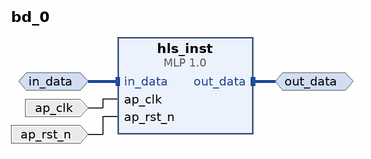
[diagram p0: block diagram of the top level]
# Vivado block design bd_0, xczu3eg-sbva484-2-i, Vivado 2022.1
create_bd_design bd_0

create_bd_intf_port -mode Slave -vlnv xilinx.com:interface:axis_rtl:1.0 in_data
set_property -dict [list \
  CONFIG.FREQ_HZ 100000000.0 \
  CONFIG.HAS_TKEEP 1 \
  CONFIG.HAS_TLAST 1 \
  CONFIG.HAS_TREADY 1 \
  CONFIG.HAS_TSTRB 1 \
  CONFIG.LAYERED_METADATA undef \
  CONFIG.TDATA_NUM_BYTES 4 \
  CONFIG.TDEST_WIDTH 6 \
  CONFIG.TID_WIDTH 5 \
  CONFIG.TUSER_WIDTH 2 \
] [get_bd_intf_ports in_data]
create_bd_intf_port -mode Master -vlnv xilinx.com:interface:axis_rtl:1.0 out_data
set_property -dict {CONFIG.FREQ_HZ 100000000.0} [get_bd_intf_ports out_data]
create_bd_port -dir I -type clk ap_clk
set_property -dict {CONFIG.FREQ_HZ 100000000.0} [get_bd_ports ap_clk]
create_bd_port -dir I -type rst ap_rst_n

create_bd_cell -type ip -vlnv xilinx.com:hls:MLP:1.0 hls_inst

# ---- connections ----

connect_bd_intf_net [get_bd_intf_ports out_data] [get_bd_intf_pins hls_inst/out_data]
connect_bd_intf_net -intf_net in_data_0_1 [get_bd_intf_ports in_data] [get_bd_intf_pins hls_inst/in_data]
connect_bd_net -net ap_clk_0_1 [get_bd_ports ap_clk] [get_bd_pins hls_inst/ap_clk]
connect_bd_net -net ap_rst_n_0_1 [get_bd_ports ap_rst_n] [get_bd_pins hls_inst/ap_rst_n]

validate_bd_design
save_bd_design
